# Altium schematic sheet Sheet2.SchDoc: Контроллер нетривиального станка с ЧПУ
size 420 x 297 mm; Author: Барков; CompanyName: BarCockSemenConductor; DrawnBy: Барков; Engineer: Барков; Organization: BarCockSemenConductor; DocumentNumber: хххххххх; Revision: 1; SheetNumber: 2; SheetTotal: 5
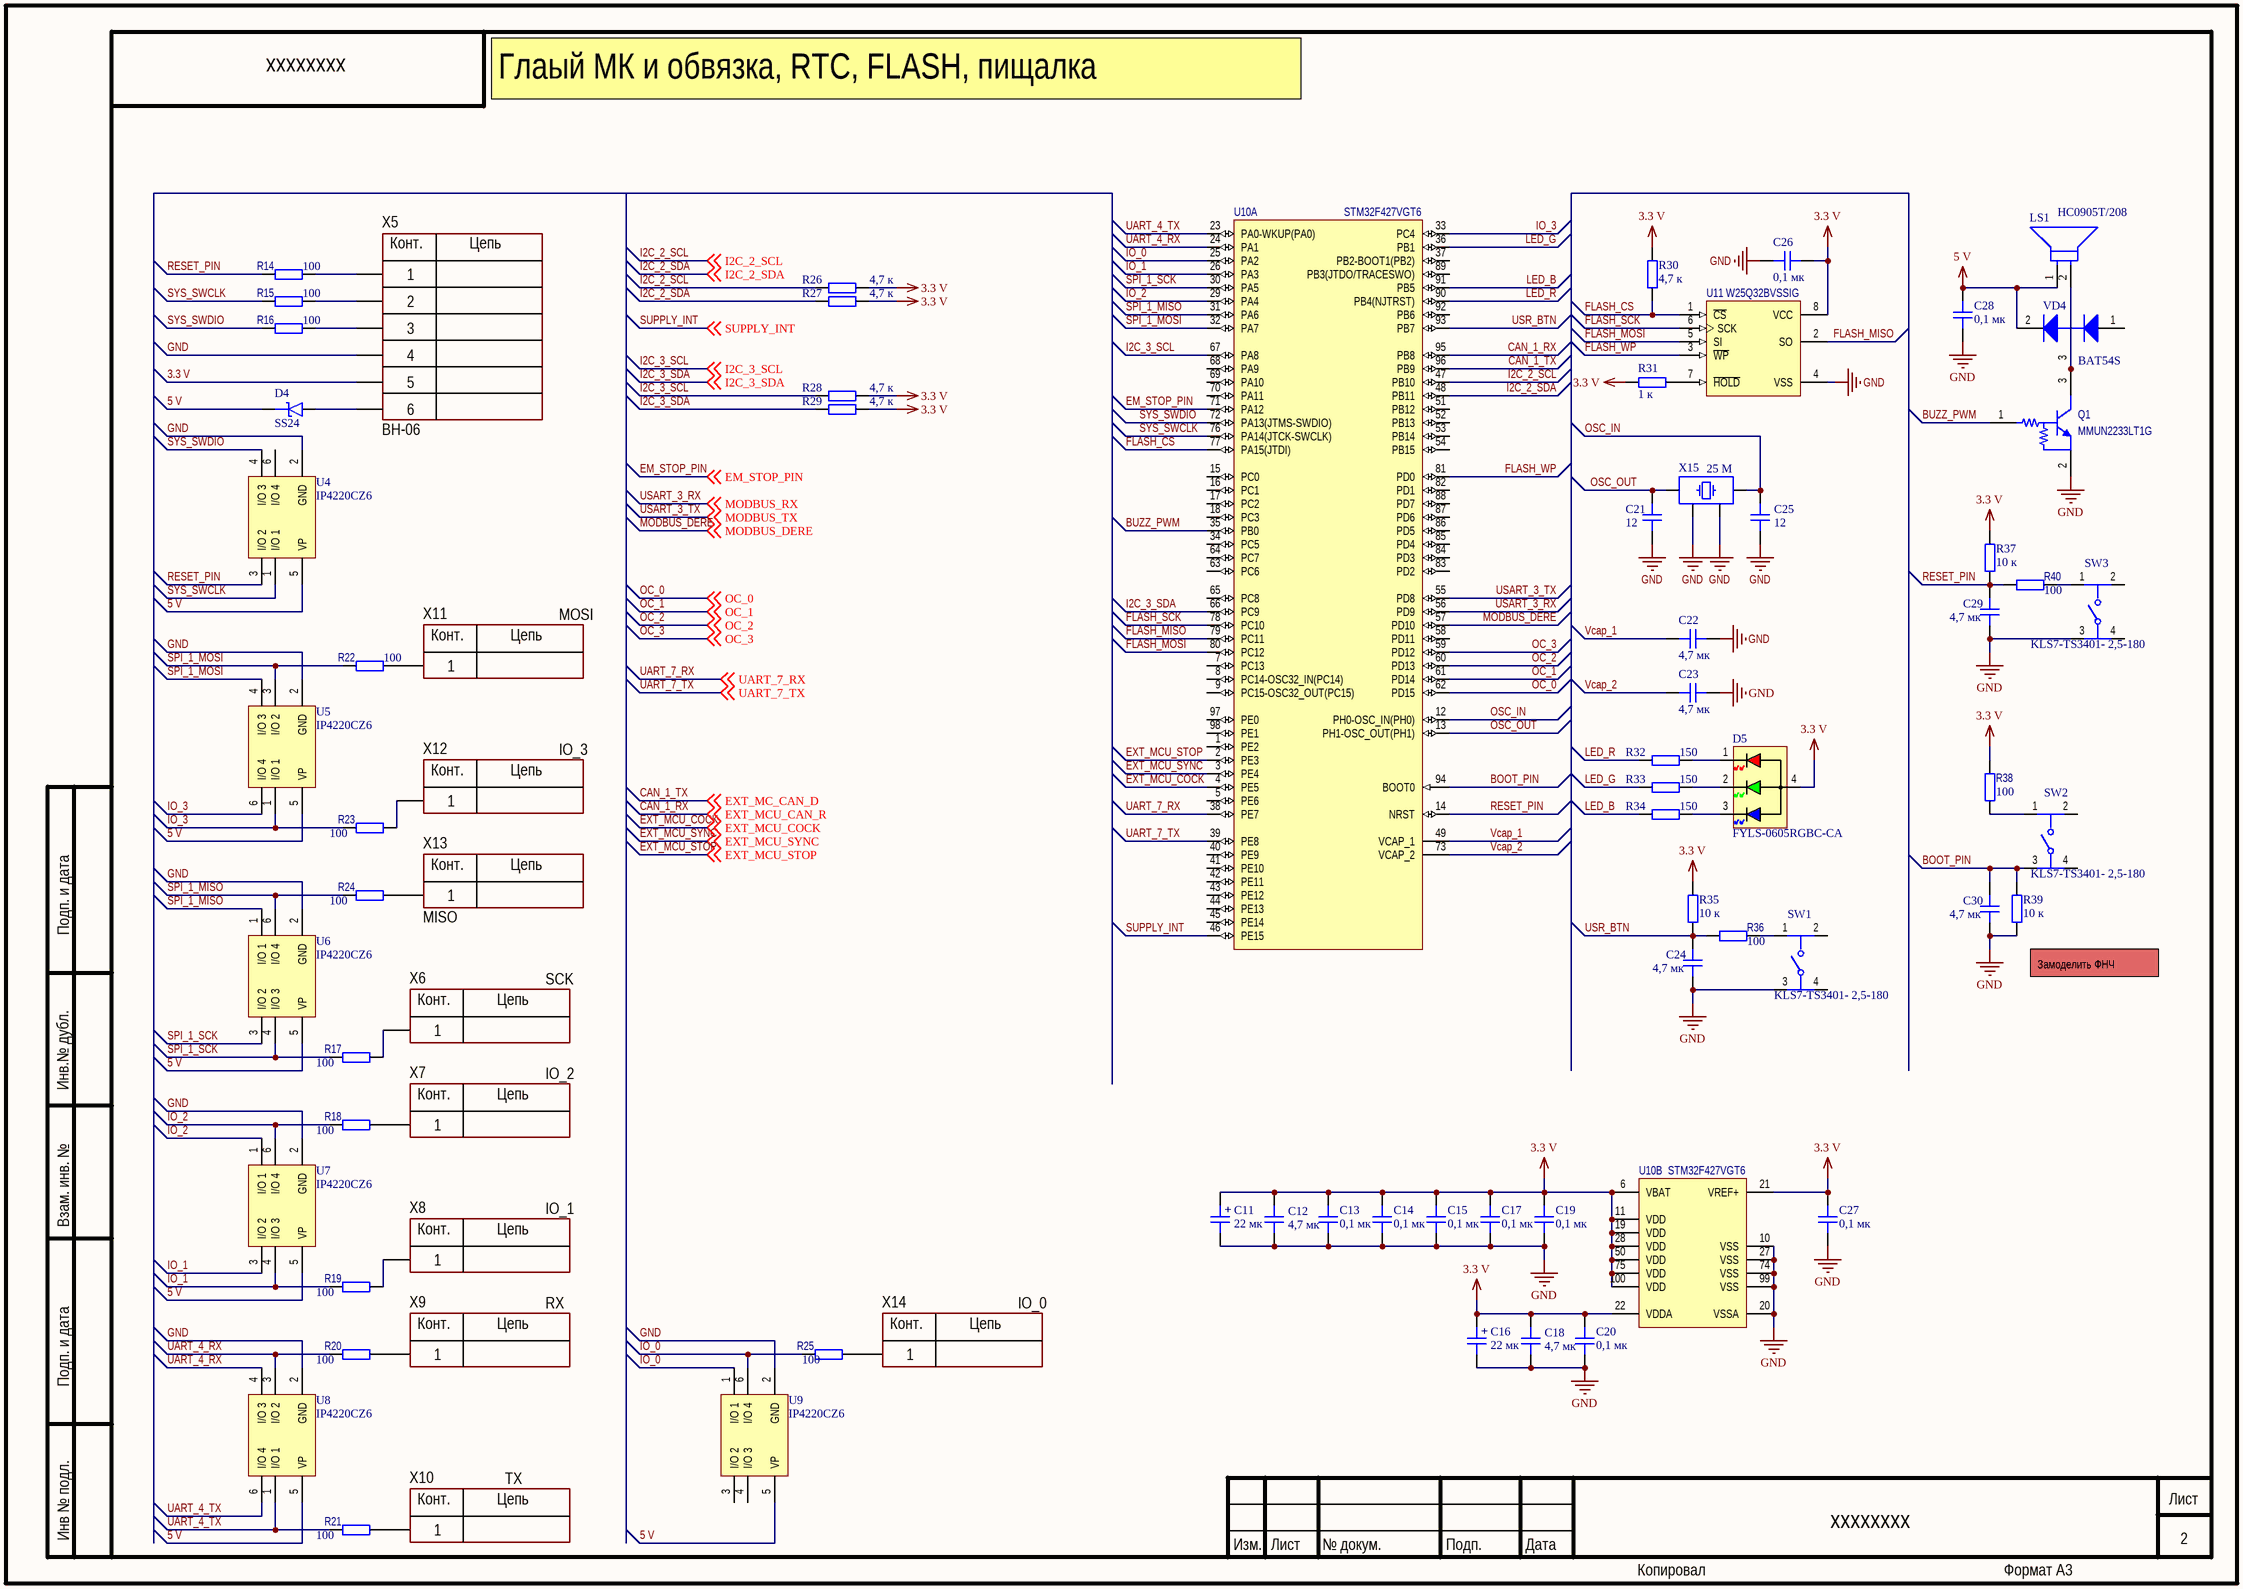
[diagram p0: Sheet2.SchDoc]

## Parts
C11  22 мк  [TANTAL_B]
C12  4,7 мк  [CAP_0805]
C13  0,1 мк  [CAP_0603]
C14  0,1 мк  [CAP_0603]
C15  0,1 мк  [CAP_0603]
C16  22 мк  [TANTAL_B]
C17  0,1 мк  [CAP_0603]
C18  4,7 мк  [CAP_0805]
C19  0,1 мк  [CAP_0603]
C20  0,1 мк  [CAP_0603]
C21  12  [CAP_0603]
C22  4,7 мк  [CAP_0805]
C23  4,7 мк  [CAP_0805]
C24  4,7 мк  [CAP_0805]
C25  12  [CAP_0603]
C26  0,1 мк  [CAP_0603]
C27  0,1 мк  [CAP_0603]
C28  0,1 мк  [CAP_0603]
C29  4,7 мк  [CAP_0805]
C30  4,7 мк  [CAP_0805]
D4  SS24  [DO-214AC-2 (SMA)]
D5  FYLS-0605RGBC-CA  [150080M153000]
LS1  HC0905T/208  [FP-SD1209-MFG]
Q1  MMUN2233LT1G  [ONSC-SOT-23-3-318-08_V]
R14  100  [RES_0603]
R15  100  [RES_0603]
R16  100  [RES_0603]
R17  100  [RES_0603]
R18  100  [RES_0603]
R19  100  [RES_0603]
R20  100  [RES_0603]
R21  100  [RES_0603]
R22  100  [RES_0603]
R23  100  [RES_0603]
R24  100  [RES_0603]
R25  100  [RES_0603]
R26  4,7 к  [RES_0603]
R27  4,7 к  [RES_0603]
R28  4,7 к  [RES_0603]
R29  4,7 к  [RES_0603]
R30  4,7 к  [RES_0603]
R31  1 к  [RES_0603]
R32  150  [RES_0603]
R33  150  [RES_0603]
R34  150  [RES_0603]
R35  10 к  [RES_0603]
R36  100  [RES_0603]
R37  10 к  [RES_0603]
R38  100  [RES_0603]
R39  10 к  [RES_0603]
R40  100  [RES_0603]
SW1  KLS7-TS3401- 2,5-180  [FP-PTS810_SJG_250_SMTR_LF-MFG]
SW2  KLS7-TS3401- 2,5-180  [FP-PTS810_SJG_250_SMTR_LF-MFG]
SW3  KLS7-TS3401- 2,5-180  [FP-PTS810_SJG_250_SMTR_LF-MFG]
U4  IP4220CZ6  [NXP-SOT457_L]
U5  IP4220CZ6  [NXP-SOT457_L]
U6  IP4220CZ6  [NXP-SOT457_L]
U7  IP4220CZ6  [NXP-SOT457_L]
U8  IP4220CZ6  [NXP-SOT457_L]
U9  IP4220CZ6  [NXP-SOT457_L]
U10  STM32F427VGT6  [STM-LQFP100_M]  (parts A,B of 2)
U11  W25Q32BVSSIG  [SOIJ-SM8_L]
VD4  BAT54S  [ONSC-SOT-323-3-419-04_V]
X5  BH-06  [CON: IDC-6MS]
X6  SCK  [CON: PADS 1x1mm]  (no BOM)
X7  IO_2  [CON: PADS 1x1mm]  (no BOM)
X8  IO_1  [CON: PADS 1x1mm]  (no BOM)
X9  RX  [CON: PADS 1x1mm]  (no BOM)
X10  TX  [CON: PADS 1x1mm]  (no BOM)
X11  MOSI  [CON: PADS 1x1mm]  (no BOM)
X12  IO_3  [CON: PADS 1x1mm]  (no BOM)
X13  MISO  [CON: PADS 1x1mm]  (no BOM)
X14  IO_0  [CON: PADS 1x1mm]  (no BOM)
X15  25 M  [XTAL_3225]

## Nets
3.3 V: C11.1 C12.1 C13.1 C14.1 C15.1 C16.1 C17.1 C18.1 C19.1 C20.1 C26.2 C27.1 D5.4(AC) R26.2 R27.2 R28.2 R29.2 R30.2 R31.1 R35.1 R37.1 R38.2 U10.6(VBAT) U10.11(VDD) U10.19(VDD) U10.21(VREF+) U10.22(VDDA) U10.28(VDD) U10.50(VDD) U10.75(VDD) U10.100(VDD) U11.8(VCC) X5.5
5 V: C28.1 D4.K LS1.1(C) U4.5(VP) U5.5(VP) U6.5(VP) U7.5(VP) U8.5(VP) U9.5(VP) VD4.2(K)
GND: C11.2 C12.2 C13.2 C14.2 C15.2 C16.2 C17.2 C18.2 C19.2 C20.2 C21.2 C22.1 C23.1 C24.2 C25.2 C26.1 C27.2 C28.2 C29.2 C30.2 Q1.2(E) R39.2 SW1.3 SW3.3 U4.2(GND) U5.2(GND) U6.2(GND) U7.2(GND) U8.2(GND) U9.2(GND) U10.10(VSS) U10.20(VSSA) U10.27(VSS) U10.74(VSS) U10.99(VSS) U11.4(VSS) X5.4 X15.2 X15.4
BOOT_PIN: C30.1 R39.1 SW2.3 U10.94(BOOT0)
BUZZ_PWM: Q1.1(B) U10.35(PB0)
CAN_1_RX: U10.95(PB8) ; off-sheet EXT_MCU_CAN_R  [also labelled EXT_MCU_CAN_R]
CAN_1_TX: U10.96(PB9) ; off-sheet EXT_MC_CAN_D  [also labelled EXT_MC_CAN_D]
EM_STOP_PIN: U10.71(PA12) ; off-sheet EM_STOP_PIN
EXT_MCU_COCK: U10.4(PE5) ; off-sheet EXT_MCU_COCK
EXT_MCU_STOP: U10.2(PE3) ; off-sheet EXT_MCU_STOP
EXT_MCU_SYNC: U10.3(PE4) ; off-sheet EXT_MCU_SYNC
FLASH_CS: R30.1 U10.77(PA15(JTDI)) U11.1(~{CS})
FLASH_MISO: U10.79(PC11) U11.2(SO)
FLASH_MOSI: U10.80(PC12) U11.5(SI)
FLASH_SCK: U10.78(PC10) U11.6(SCK)
FLASH_WP: U10.81(PD0) U11.3(~{WP})
I2C_2_SCL: R26.1 U10.47(PB10) ; off-sheet I2C_2_SCL
I2C_2_SDA: R27.1 U10.48(PB11) ; off-sheet I2C_2_SDA
I2C_3_SCL: R28.1 U10.67(PA8) ; off-sheet I2C_3_SCL
I2C_3_SDA: R29.1 U10.66(PC9) ; off-sheet I2C_3_SDA
IO_0: R25.1 U9.1(I/O_1) U9.6(I/O_4) U10.25(PA2)
IO_1: R19.1 U7.3(I/O_2) U7.4(I/O_3) U10.26(PA3)
IO_2: R18.1 U7.1(I/O_1) U7.6(I/O_4) U10.29(PA4)
IO_3: R23.1 U5.1(I/O_1) U5.6(I/O_4) U10.33(PC4)
LED_B: R34.1 U10.91(PB5)
LED_G: R33.1 U10.36(PB1)
LED_R: R32.1 U10.90(PB4(NJTRST))
MODBUS_DERE: U10.57(PD10) ; off-sheet MODBUS_DERE
OC_0: U10.62(PD15) ; off-sheet OС_0  [also labelled OС_0]
OC_1: U10.61(PD14) ; off-sheet OС_1  [also labelled OС_1]
OC_2: U10.60(PD13) ; off-sheet OС_2  [also labelled OС_2]
OC_3: U10.59(PD12) ; off-sheet OС_3  [also labelled OС_3]
OSC_IN: C25.1 U10.12(PH0-OSC_IN(PH0)) X15.3
OSC_OUT: C21.1 U10.13(PH1-OSC_OUT(PH1)) X15.1
RESET_PIN: C29.1 R14.1 R37.2 R40.2 U4.3(I/O_2) U10.14(NRST)
SPI_1_MISO: R24.1 U6.1(I/O_1) U6.6(I/O_4) U10.31(PA6)
SPI_1_MOSI: R22.1 U5.3(I/O_2) U5.4(I/O_3) U10.32(PA7)
SPI_1_SCK: R17.1 U6.3(I/O_2) U6.4(I/O_3) U10.30(PA5)
SUPPLY_INT: U10.46(PE15) ; off-sheet SUPPLY_INT
SYS_SWCLK: R15.1 U4.1(I/O_1) U10.76(PA14(JTCK-SWCLK))
SYS_SWDIO: R16.1 U4.4(I/O_3) U10.72(PA13(JTMS-SWDIO))
UART_4_RX: R20.1 U8.3(I/O_2) U8.4(I/O_3) U10.24(PA1)
UART_4_TX: R21.1 U8.1(I/O_1) U8.6(I/O_4) U10.23(PA0-WKUP(PA0))
UART_7_RX: U10.38(PE7) ; off-sheet UART_7_RX
UART_7_TX: U10.39(PE8) ; off-sheet UART_7_TX
USART_3_RX: U10.56(PD9) ; off-sheet MODBUS_RX  [also labelled MODBUS_RX]
USART_3_TX: U10.55(PD8) ; off-sheet MODBUS_TX  [also labelled MODBUS_TX]
USR_BTN: C24.1 R35.2 R36.2 U10.93(PB7)
Vcap_1: C22.2 U10.49(VCAP_1)
Vcap_2: C23.2 U10.73(VCAP_2)
NetD4_A: D4.A X5.6
NetD5_1: D5.1(CR) R32.2
NetD5_2: D5.2(CG) R33.2
NetD5_3: D5.3(CB) R34.2
NetLS1_2: LS1.2(A) Q1.3(C) VD4.3(K/A)
NetR14_2: R14.2 X5.1
NetR15_2: R15.2 X5.2
NetR16_2: R16.2 X5.3
NetR17_2: R17.2 X6.1
NetR18_2: R18.2 X7.1
NetR19_2: R19.2 X8.1
NetR20_2: R20.2 X9.1
NetR21_2: R21.2 X10.1
NetR22_2: R22.2 X11.1
NetR23_2: R23.2 X12.1
NetR24_2: R24.2 X13.1
NetR25_2: R25.2 X14.1
NetR31_2: R31.2 U11.7(~{HOLD})
NetR36_1: R36.1 SW1.1
NetR38_1: R38.1 SW2.1
NetR40_1: R40.1 SW3.1

Not connected (* = marked no-connect by the designer): SW1 2 4; SW2 2 4; SW3 2 4; U4 6(I/O_4); U9 3(I/O_2) 4(I/O_3); U10 1(PE2) 5(PE6) 7(PC13) 8(PC14-OSC32_IN(PC14)) 9(PC15-OSC32_OUT(PC15)) 15(PC0) 16(PC1) 17(PC2) 18(PC3) 34(PC5) 37(PB2-BOOT1(PB2)) 40(PE9) 41(PE10) 42(PE11) 43(PE12) 44(PE13) 45(PE14) 51(PB12) 52(PB13) 53(PB14) 54(PB15) 58(PD11) 63(PC6) 64(PC7) 65(PC8) 68(PA9) 69(PA10) 70(PA11) 82(PD1) 83(PD2) 84(PD3) 85(PD4) 86(PD5) 87(PD6) 88(PD7) 89(PB3(JTDO/TRACESWO)) 92(PB6) 97(PE0) 98(PE1); VD4 1(A)

## Notes on the sheet
- Глаый МК и обвязка, RTC, FLASH, пищалка
- Замоделить ФНЧ
- Подп. и дата
- Инв.№ дубл.
- Взам. инв. №
- Инв № подл.
- Изм.
- Лист
- № докум.
- Подп.
- Дата
- Копировал
- Формат А3
- (in symbol 1-Connector) Конт.; Цепь
- (in symbol 6-Connector) Конт.; Цепь
- (in symbol CAP_ALEL_16x16.5_25V) +

## Library data of the parts
C11 C16 = CAP_ALEL_16x16.5_25V: Capacitor SMD Aluminium Electrolytic 16x16.5mm 25V; Voltage: 6,3; Type: CAP_TANTALUM; ChipDip: 9000629219; Value: 22 мк; Model: *
C12 C18 C22-C24 C29 C30 = CAP_0805: Capacitor SMD 0805; Type: CAP_CERAMIC; Value: 4,7 мк; ChipDip: *
C13-C15 C17 C19-C21 C25-C28 = CAP_0603: Capacitor SMD 0603; Type: CAP_CERAMIC; ChipDip: *
  C13-C15 C17 C19 C20 C26-C28: Value: 0,1 мк
  C21 C25: Value: 12
D4 = D_SCHOTTKY_SMA: Diode Schottky SMD SMA (DO-214AA); ChipDip: 9001106111; Model: SS24; Type: DIODE
D5 = 150080M153000: RGB LED Common Anode SMD Diffused 0805 Top View; ChipDip: 9001271035; Model: FYLS-0605RGBC-CA; Type: LED
LS1 = CMP-08413-000009-1: AUDIO MAGNETIC XDCR 3-6V TH; ChipDip: 9000783782; Model: HC0905T/208; Type: SOUND
Q1 = CMP-0630-00251-1: Digital Transistor (BRT), R1=4.7 kOhm, R2=47 kOhm, NPN Transistor, 3-Pin SOT-23, Pb-Free, Tape and Reel; ChipDip: 8021345115; Type: MOSFET; ComponentLink3URL: http://www.onsemi.cn/pub_link/Collateral/318-08.PDF; ComponentLink1URL: http://www.onsemi.com/; ComponentLink3Description: Package Specification; ComponentLink2URL: http://www.onsemi.cn/pub_link/Collateral/DTC143Z-D.PDF; ComponentLink1Description: Manufacturer URL; ComponentLink2Description: Datasheet; Model: MMUN2233LT1G
R14-R40 = RES_0603: Resistor SMD 0603; Type: RESISTOR; ChipDip: *
  R14-R25 R36 R38 R40: Value: 100
  R26-R30: Value: 4,7 к
  R31: Value: 1 к
  R32-R34: Value: 150
  R35 R37 R39: Value: 10 к
SW1-SW3 = CMP-10040-000011-1: SWITCH TACTILE SPST-NO 0.05A 16V; ChipDip: 9000372886; ComponentLink2URL: https://www.ckswitches.com/media/1476/pts810.pdf; ComponentLink2Description: Datasheet; Model: KLS7-TS3401- 2,5-180; Type: SWITCH
U4-U9 = CMP-2000-06457-1: ChipDip: 9001067611; Model: IP4220CZ6; Type: IC
U10 = CMP-0243-00028-2: ARM Cortex-M4 32-bit MCU+FPU, 210 DMIPS, 1024 kB Flash, 256 kB Internal RAM, 82 I/Os, 100-pin LQFP, -40 to 85 degC, Tray; ChipDip: 9001570276; ComponentLink1Description: Manufacturer URL; ComponentLink2URL: http://www.st.com/st-web-ui/static/active/en/resource/technical/document/datasheet/DM00071990.pdf; ComponentLink1URL: http://www.st.com/web/en/home.html; ComponentLink2Description: Datasheet; ComponentLink3Description: Package Specification; ComponentLink3URL: http://www.st.com/st-web-ui/static/active/en/resource/technical/document/data_brief/DM00071938.pdf; Type: IC; Model: STM32F427VGT6
U11 = CMP-0165-00255-1: 1 Mbit SPI Bus Serial EEPROM, 8-Pin SOIC, Industrial Temperature, Tape and Reel; Model: W25Q32BVSSIG; Type: IC; ChipDip: *
VD4 = CMP-1055-00559-1: ChipDip: 9001106105; Type: DIODE; ComponentLink1URL: http://www.onsemi.com/; ComponentLink1Description: Manufacturer URL; ComponentLink3URL: http://www.onsemi.com/pub_link/Collateral/419-04.PDF; ComponentLink2URL: http://www.onsemi.cn/pub_link/Collateral/BAT54SWT1-D.PDF; ComponentLink3Description: Package Specification; ComponentLink2Description: Datasheet; Model: BAT54S
X5 = 6-Connector: ChipDip: 9000058155; Model: BH-06; Type: CONNECTOR
X6-X14 = 1-Connector
  X6: SIGNAL: SCK
  X7: SIGNAL: IO_2
  X8: SIGNAL: IO_1
  X9: SIGNAL: RX
  X10: SIGNAL: TX
  X11: SIGNAL: MOSI
  X12: SIGNAL: IO_3
  X13: SIGNAL: MISO
  X14: SIGNAL: IO_0
X15 = TSX-3225_24.0000MF15X-AC: Crystal SMD 24MHz 10PPM 7pF 3225; ChipDip: 8026581531; Model: X322525MOB4SI; Value: 25 M; Type: CRYSTAL